# EAGLE design sauroneye (EAGLE 6.3)
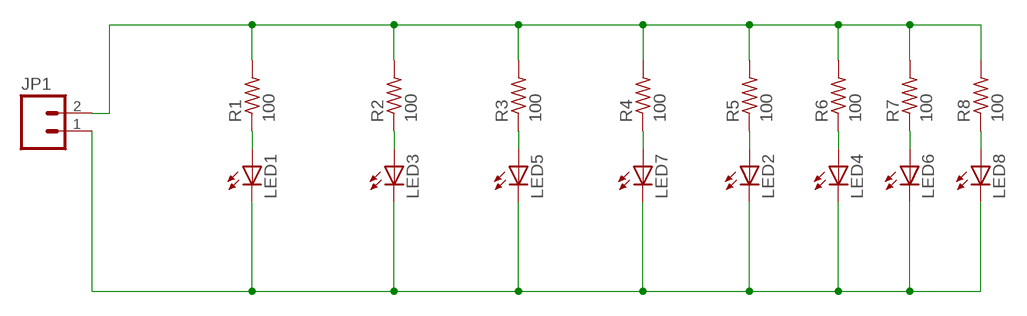
[diagram p0: schematic, sheet 1]

## Parts
JP1  M02PTH  [1X02]
LED1  LEDCHIP-LED0805  [CHIP-LED0805]
LED2  LEDCHIP-LED0805  [CHIP-LED0805]
LED3  LEDCHIP-LED0805  [CHIP-LED0805]
LED4  LEDCHIP-LED0805  [CHIP-LED0805]
LED5  LEDCHIP-LED0805  [CHIP-LED0805]
LED6  LEDCHIP-LED0805  [CHIP-LED0805]
LED7  LEDCHIP-LED0805  [CHIP-LED0805]
LED8  LEDCHIP-LED0805  [CHIP-LED0805]
R1  100  R-US_R0805  [R0805]
R2  100  R-US_R0805  [R0805]
R3  100  R-US_R0805  [R0805]
R4  100  R-US_R0805  [R0805]
R5  100  R-US_R0805  [R0805]
R6  100  R-US_R0805  [R0805]
R7  100  R-US_R0805  [R0805]
R8  100  R-US_R0805  [R0805]

## Nets
N$1: JP1.2 R1.2 R2.2 R3.2 R4.2 R5.2 R6.2 R7.2 R8.2
N$2: LED1.A R1.1
N$3: LED3.A R2.1
N$4: LED5.A R3.1
N$5: LED7.A R4.1
N$6: JP1.1 LED1.C LED2.C LED3.C LED4.C LED5.C LED6.C LED7.C LED8.C
N$7: LED2.A R5.1
N$8: LED4.A R6.1
N$9: LED6.A R7.1
N$10: LED8.A R8.1

## Library data of the parts
JP1 = SparkFun-Connectors:M02: Header 2 Standard 2-pin 0.1" header. Use with straight break away headers (SKU : PRT-00116), right angle break away headers (PRT-00553), swiss pins (PRT-00743), machine pins (PRT-00117), and female headers (PRT-00115). Molex polarized connector foot print use with SKU : PRT-08233 with associated crimp pins and housings.
LED1-LED8 = adafruit:LED: LED OSRAM: - CHIPLED LG R971, LG N971, LY N971, LG Q971, LY Q971, LO R971, LY R971 LH N974, LH R974 LS Q976, LO Q976, LY Q976 LO Q996 - Hyper CHIPLED LW Q18S LB Q993, LB Q99A, LB R99A - SideLED LS A670, LO A670, LY A670, LG A670, LP A670 LB A673, LV A673, LT A673, LW A673 LH A674 LY A675 LS A676, LA A676, LO A676, LY A676, LW A676 LS A679, LY A679, LG A679 - Hyper Micro SIDELED® LS Y876, LA Y876, LO Y876, LY Y876 LT Y87S - SmartLED LW L88C, LW L88S LB L89C, LB L89S, LG L890 LS L89K, LO L89K, LY L89K LS L896, LA L896, LO L896, LY L896 - TOPLED LS T670, LO T670, LY T670, LG T670, LP T670 LSG T670, LSP T670, LSY T670, LOP T670, LYG T670 LG T671, LOG T671, LSG T671 LB T673, LV T673, LT T673, LW T673 LH T674 LS T676, LA T676, LO T676, LY T676, LB T676, LH T676, LSB T676, LW T676 LB T67C, LV T67C, LT T67C, LS T67K, LO T67K, LY T67K, LW E67C LS E67B, LA E67B, LO E67B, LY E67B, LB E67C, LV E67C, LT E67C LW T67C LS T679, LY T679, LG T679 LS T770, LO T770, LY T770, LG T770, LP T770 LB T773, LV T773, LT T773, LW T773 LH T774 LS E675, LA E675, LY E675, LS T675 LS T776, LA T776, LO T776, LY T776, LB T776 LHGB T686 LT T68C, LB T68C - Hyper Mini TOPLED® LB M676 - Mini TOPLED Santana® LG M470 LS M47K, LO M47K, LY M47K Source: http://www.osram.convergy.de/
R1-R8 = adafruit:R-US_: RESISTOR, American symbol

## Board
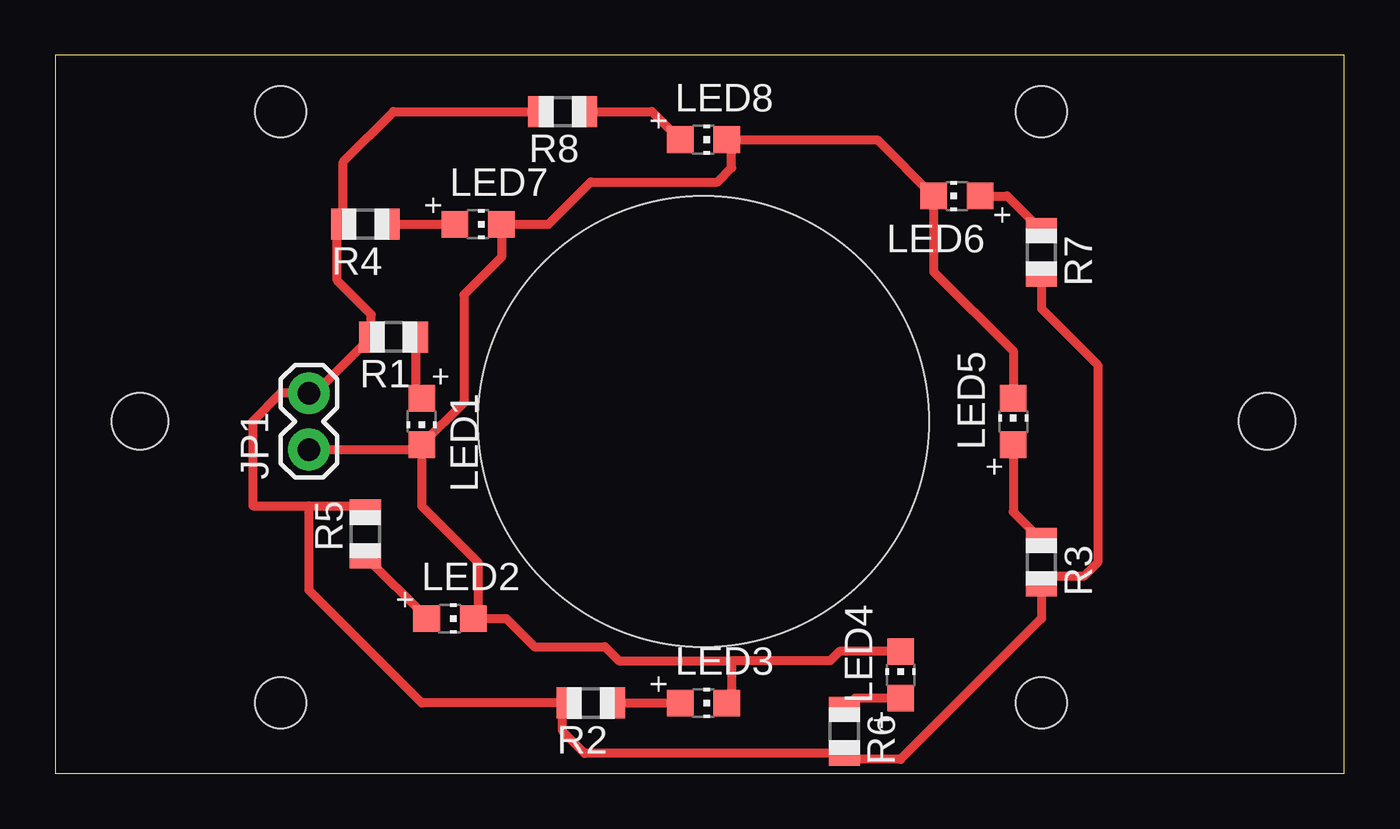
[diagram p1: board, top side]

Size 58.09 x 32.38 mm. Coordinates in mm from the lower left corner, seen from the top.
Outline: 0,0 58.09,0 58.09,32.38 0,32.38 0,0
Copper layers (1*16): Top 0.035559375mm / dielectric 1.501140625mm / Bottom 0.035559375mm
Design rules "lpkf-strict": minimum track width 4mil, minimum drill 0.39878125mm, track to track 4mil, track to pad 4mil, pad to pad 4mil, via to via 8mil, smd to smd 4mil, copper to edge 8mil, drill to drill 8mil, minimum pad ring 10mil, minimum via ring 8mil, stop-mask expansion 4mil, vias tented up to drill 0mil, thermal gap 10mil
Holes 20.32 mm at 29.21,15.88
Holes 2.29 mm at 44.45,29.84 10.16,29.84 10.16,3.17 44.45,3.17
Holes 2.54 mm at 54.61,15.88 3.81,15.88

### Footprints (pad centres in the part's own frame; a part is rotated, then mirrored left to right if it is on the bottom)
1X02 = drill 1.016 pad 1.88: 1 0,0; 2 2.54,0
CHIP-LED0805 = smd 1.2 x 1.2: A 0,-1.05; C 0,1.05
R0805 = smd 1.1 x 1.4: 1 -1,0; 2 1,0

### Placement (x,y rotation side)
JP1  11.43,14.61 90 top
LED1  16.51,15.88 180 top
LED2  17.78,6.99 270 top
LED3  29.21,3.17 270 top
LED4  38.1,4.45 0 top
LED5  43.18,15.88 0 top
LED6  40.64,26.04 90 top
LED7  19.05,24.77 270 top
LED8  29.21,28.57 270 top
R1  15.24,19.68 180 top
R2  24.13,3.17 180 top
R3  44.45,9.53 270 top
R4  13.97,24.77 180 top
R5  13.97,10.79 90 top
R6  35.56,1.91 270 top
R7  44.45,23.5 270 top
R8  22.86,29.84 180 top

### Tracks (layer width: path | path; a pad name or v marks a point on that pad's centre or on a via)
N$1
  Top 0.406: R8.2 15.24,29.84 12.97,27.57 R4.2 12.7,24.5 12.7,22.23 14.24,20.68 R1.2 11.7,17.14 JP1.2 10.16,17.14 8.89,15.88 8.89,12.06 11.43,12.06 | 11.43,12.06 13.7,12.06 R5.2 | 11.43,12.06 11.43,8.26 16.51,3.17 R2.2 22.86,2.9 22.86,1.91 23.86,0.91 R6.2 35.83,0.64 38.1,0.64 44.45,6.99 R3.2 44.81,8.89 46.35,8.89 46.99,9.53 46.99,18.41 44.45,20.95 R7.2
N$2
  Top 0.406: R1.1 16.24,17.2 LED1.A
N$3
  Top 0.406: R2.1 LED3.A
N$4
  Top 0.406: LED5.A 43.18,11.79 R3.1
N$5
  Top 0.406: R4.1 LED7.A
N$6
  Top 0.406: JP1.1 16.29,14.61 LED1.C | LED1.C 16.51,12.06 19.05,9.53 19.05,7.21 LED2.C 20.32,6.99 21.59,5.71 24.77,5.71 25.4,5.08 30.48,5.08 | 30.48,5.08 30.48,3.4 LED3.C | LED4.C 35.34,5.5 34.92,5.08 30.48,5.08 | LED5.C 43.18,19.05 39.59,22.64 LED6.C 37.05,28.57 LED8.C 30.48,28.36 30.48,27.3 29.84,26.67 24.13,26.67 22.23,24.77 LED7.C 20.1,23.27 18.41,21.59 18.41,16.73 LED1.C
N$7
  Top 0.406: LED2.A 16.73,7.04 R5.1
N$8
  Top 0.406: LED4.A 36.05,3.4 R6.1
N$9
  Top 0.406: LED6.A 42.91,26.04 R7.1
N$10
  Top 0.406: R8.1 26.89,29.84 LED8.A